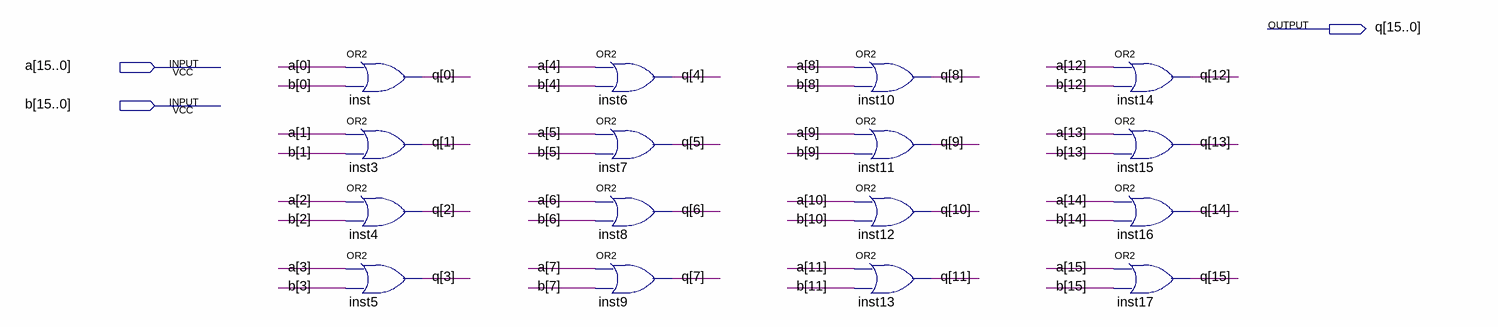
[diagram p0: schematic sheet]
// Quartus schematic OR_16.bdf as structural Verilog: 16 symbols, 3 pins
module OR_16 (
  input  [15:0] a,
  input  [15:0] b,
  output [15:0] q
);

  or inst (q[0], a[0], b[0]);
  or inst3 (q[1], a[1], b[1]);
  or inst4 (q[2], a[2], b[2]);
  or inst5 (q[3], a[3], b[3]);
  or inst6 (q[4], a[4], b[4]);
  or inst7 (q[5], a[5], b[5]);
  or inst8 (q[6], a[6], b[6]);
  or inst9 (q[7], a[7], b[7]);
  or inst10 (q[8], a[8], b[8]);
  or inst11 (q[9], a[9], b[9]);
  or inst12 (q[10], a[10], b[10]);
  or inst13 (q[11], a[11], b[11]);
  or inst14 (q[12], a[12], b[12]);
  or inst15 (q[13], a[13], b[13]);
  or inst16 (q[14], a[14], b[14]);
  or inst17 (q[15], a[15], b[15]);
endmodule
